# EAGLE design hacker-boards-refactor (EAGLE 7.3.0)
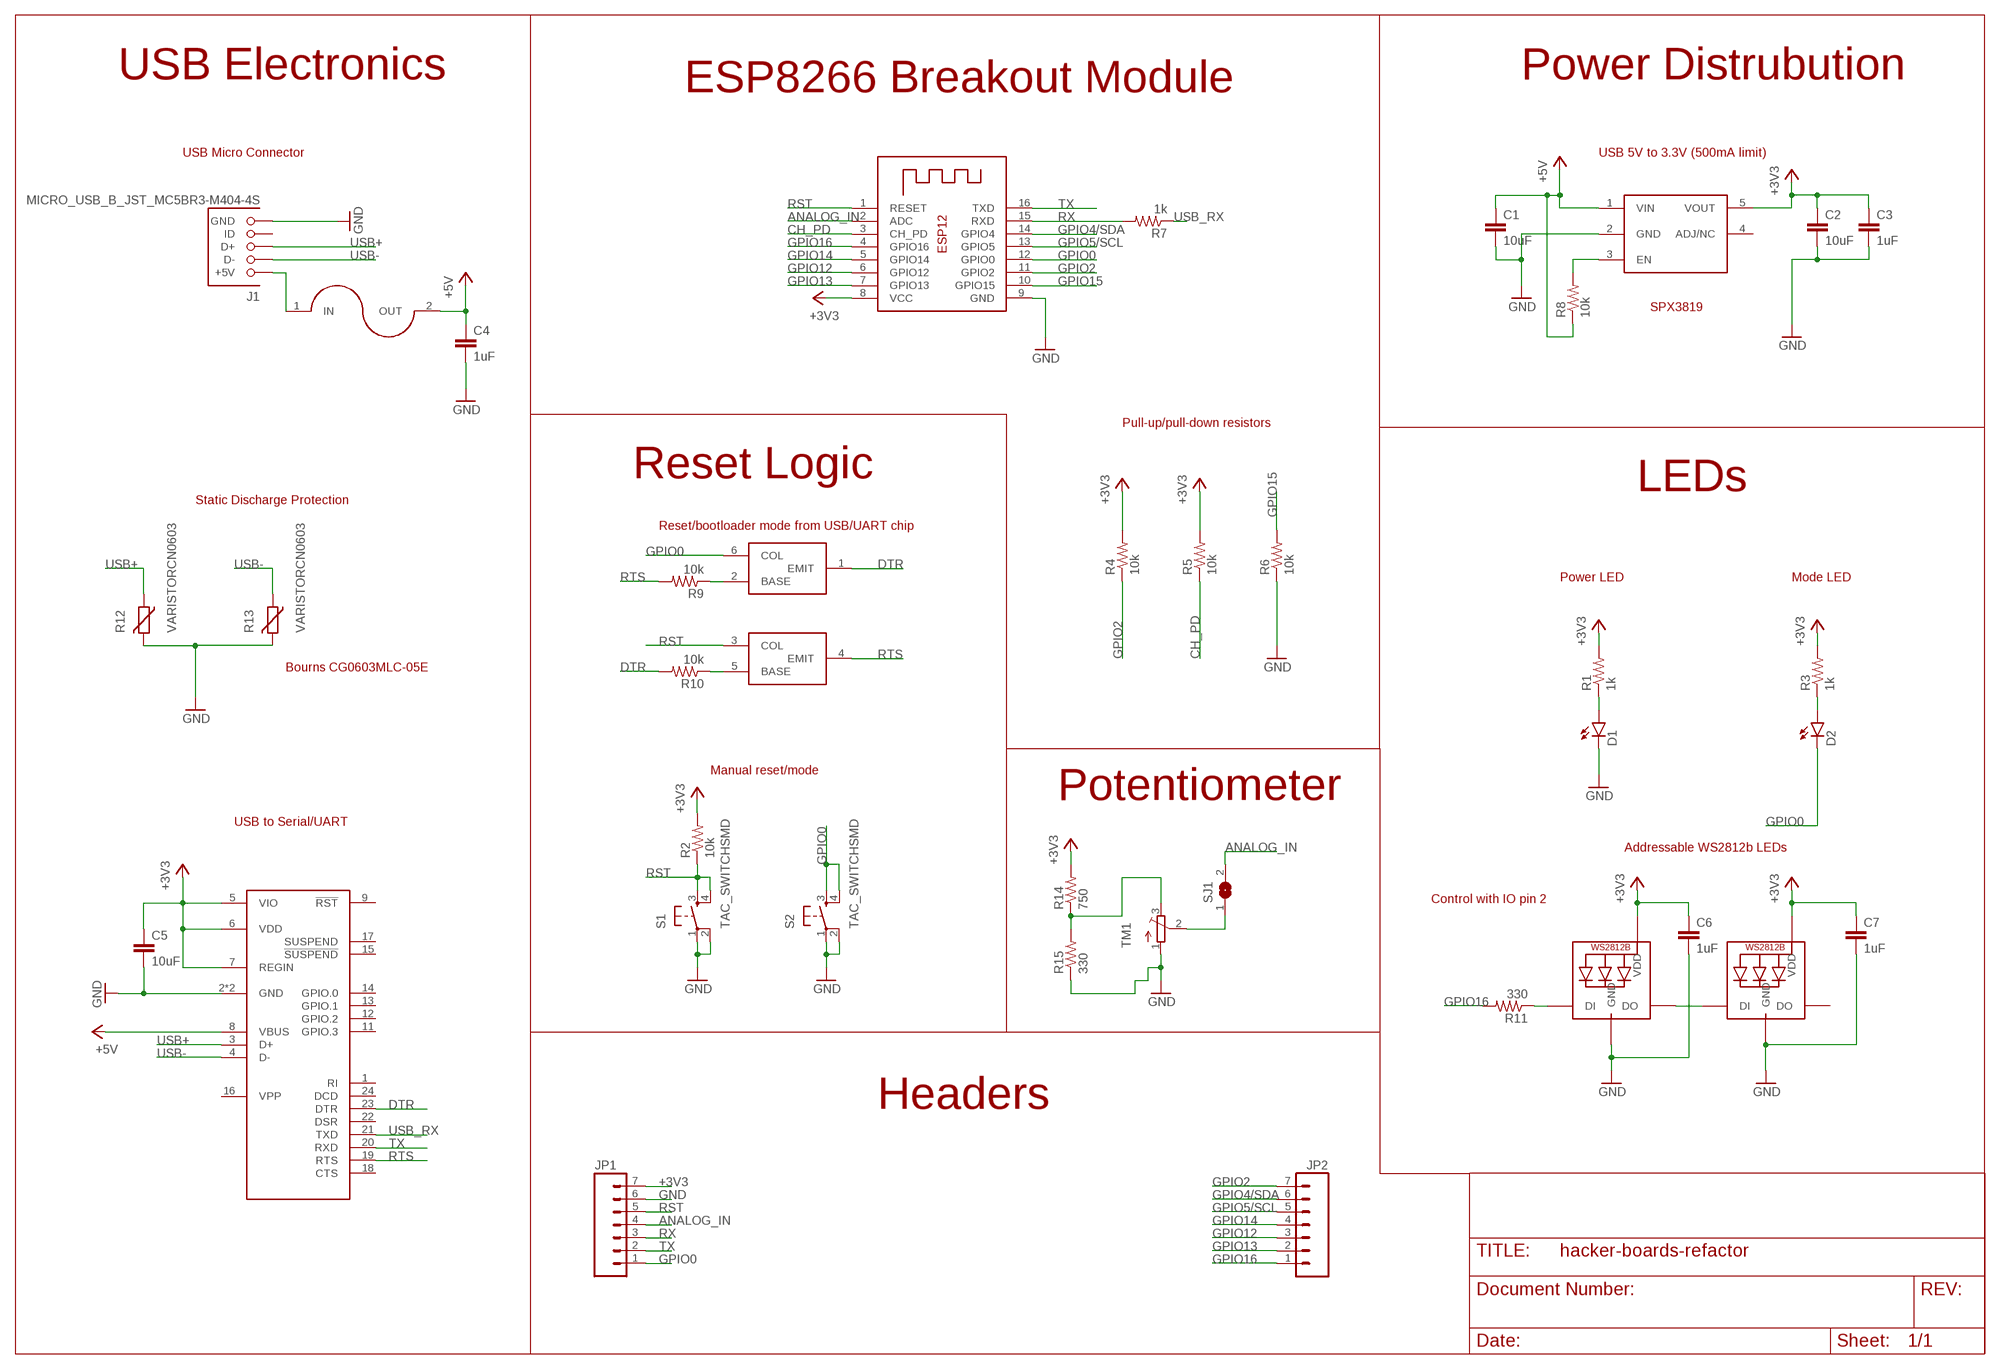
[diagram p0: schematic, sheet 1]

## Parts
C1  10uF  C0805  [C0805]
C2  10uF  C0805  [C0805]
C3  1uF  C0805  [C0805]
C4  1uF  C0805  [C0805]
C5  10uF  C0805  [C0805]
C6  1uF  C0805  [C0805]
C7  1uF  C0805  [C0805]
D1  LED0603  [LED-0603]
D2  LED0603  [LED-0603]
J1  MICRO_USB_B_JST_MC5BR3-M404-4S  [USB_MICRO_B-JST-MC5BR3-M404-4S-TB]
JP1  M07LONGPADS  [1X07_LONGPADS]
JP2  M07LONGPADS  [1X07_LONGPADS]
LED1  WS2812B5050  [WS2812B]
LED2  WS2812B5050  [WS2812B]
R1  1k  R-US_R0805  [R0805]
R2  10k  R-US_R0805  [R0805]
R3  1k  R-US_R0805  [R0805]
R4  10k  R-US_R0805  [R0805]
R5  10k  R-US_R0805  [R0805]
R6  10k  R-US_R0805  [R0805]
R7  1k  R-US_R0805  [R0805]
R8  10k  R-US_R0805  [R0805]
R9  10k  R-US_R0805  [R0805]
R10  10k  R-US_R0805  [R0805]
R11  330  R-US_R0805  [R0805]
R12  VARISTORCN0603  [CT/CN0603]
R13  VARISTORCN0603  [CT/CN0603]
R14  750  R-US_R0805  [R0805]
R15  330  R-US_R0805  [R0805]
S1  TAC_SWITCHSMD  [TACTILE-SWITCH-SMD]
S2  TAC_SWITCHSMD  [TACTILE-SWITCH-SMD]
SJ1  SJ  [SJ]
TM1  TRIMPOTTC33X  [TC33X]
U$1  USB-FUSE  [L1812]
U$2  AP2112  [SOT23-5L]
U$3  CP2104  [QFN24_4X4]
U$4  MBT3904DW1T1G  [SOT363]
X1  ESP-12  [ESP-12]

## Nets
+3V3: C2.1 C3.1 C5.1 C6.1 C7.1 JP1.7 LED1.1-VDD(VDD) LED2.1-VDD(VDD) R1.2 R2.2 R3.2 R4.2 R5.2 R14.2 U$2.5(VOUT) U$3.5(VIO) U$3.6(VDD) U$3.7(REGIN) X1.8(VCC)
+5V: C1.1 C4.1 R8.1 U$1.2(OUT) U$2.1(VIN) U$3.8(VBUS)
ANALOG_IN: JP1.4 SJ1.2 X1.2(ADC)
CH_PD: R5.1 X1.3(CH_PD)
DTR: R10.2 U$3.23(DTR) U$4.1(EMIT)
GND: C1.2 C2.2 C3.2 C4.2 C5.2 C6.2 C7.2 D1.C J1.5(GND) JP1.6 LED1.3-GND(GND) LED2.3-GND(GND) R6.1 R12.2 R13.2 R15.1 S1.1 S1.2 S2.1 S2.2 TM1.1(A) U$2.2(GND) U$3.2(GND) U$3.25(GND) X1.9(GND)
GPIO0: D2.C JP1.1 S2.3 S2.4 U$4.6(COL) X1.12(GPIO0)
GPIO2: JP2.7 R4.1 X1.11(GPIO2)
GPIO4/SDA: JP2.6 X1.14(GPIO4)
GPIO5/SCL: JP2.5 X1.13(GPIO5)
GPIO12: JP2.3 X1.6(GPIO12)
GPIO13: JP2.2 X1.7(GPIO13)
GPIO14: JP2.4 X1.5(GPIO14)
GPIO15: R6.2 X1.10(GPIO15)
GPIO16: JP2.1 R11.2 X1.4(GPIO16)
N$1: D1.A R1.1
N$2: J1.1(+5V) U$1.1(IN)
N$3: D2.A R3.1
N$4: R14.1 R15.2 TM1.3(E)
N$5: LED1.2-DOUT(DO) LED2.4-DIN(DI)
N$6: LED1.4-DIN(DI) R11.1
N$7: R8.2 U$2.3(EN)
N$8: R9.1 U$4.2(BASE)
N$11: R10.1 U$4.5(BASE)
N$12: SJ1.1 TM1.2(S)
RST: JP1.5 R2.1 S1.3 S1.4 U$4.3(COL) X1.1(RESET)
RTS: R9.2 U$3.19(RTS) U$4.4(EMIT)
RX: JP1.3 R7.2 X1.15(RXD)
TX: JP1.2 U$3.20(RXD) X1.16(TXD)
USB+: J1.3(D+) R12.1 U$3.3(D+)
USB-: J1.2(D-) R13.1 U$3.4(D-)
USB_RX: R7.1 U$3.21(TXD)
Unconnected: J1.4(ID) LED2.2-DOUT(DO) U$2.4(ADJ/NC) U$3.1(RI) U$3.9(!RST) U$3.11(GPIO.3) U$3.12(GPIO.2) U$3.13(GPIO.1) U$3.14(GPIO.0) U$3.15(!SUSPEND) U$3.16(VPP) U$3.17(SUSPEND) U$3.18(CTS) U$3.22(DSR) U$3.24(DCD)

## Notes on the sheet
- USB Electronics | Power Distrubution
- ESP8266 Breakout Module
- USB Micro Connector | USB 5V to 3.3V (500mA limit)
- SPX3819
- Pull-up/pull-down resistors
- Reset Logic
- LEDs
- Static Discharge Protection
- Reset/bootloader mode from USB/UART chip
- Power LED | Mode LED
- Bourns CG0603MLC-05E
- Manual reset/mode
- Potentiometer
- USB to Serial/UART
- Addressable WS2812b LEDs
- Control with IO pin 2
- Headers

## Library data of the parts
C1-C7 = hacker-board:C
D1 D2 = hacker-board:LED: LEDs Standard schematic elements and footprints for 5mm, 3mm, 1206, and 0603 sized LEDs. 5mm - Spark Fun Electronics SKU : COM-00529 (and others)
J1 = hacker-board:MICRO_USB_B_JST_MC5BR3-M404-4S: Micro USB B mid mount; DIGIKEY: 455-2567-2-ND; MOUSER: 53X3655
JP1 JP2 = hacker-board:M07: Header 7 Standard 7-pin 0.1" header. Use with straight break away headers (SKU : PRT-00116), right angle break away headers (PRT-00553), swiss pins (PRT-00743), machine pins (PRT-00117), and female headers (PRT-00115). NOTES ON THE VARIANTS LOCK and LOCK_LONGPADS... This footprint was designed to help hold the alignment of a through-hole component (i.e. 7-pin header) while soldering it into place. You may notice that each hole has been shifted either up or down by 0.005 of an inch from it's more standard position (which is usually a perfectly straight line). This slight alteration caused the pins (the squares in the middle) to touch the edges of the holes. Because they are alternating, it causes a "brace" to hold the header in place. 0.005 has proven to be the perfect amount of "off-center" position when using our standard breakaway headers. Although looks a little odd when you look at the bare footprint, once you have a header in there, the alteration is very hard to notice. Also, if you push a header all the way into place, it is covered up entirely on the bottom side. This idea of altering the position of holes to aid alignment will be further integrated into the Sparkfun Library for other footprints. It can help hold any component with 3 or more connection pins.
LED1 LED2 = hacker-board:WS2812B
R1-R11 R14 R15 = resistor:R-US_: RESISTOR, American symbol
R12 R13 = varistor:VARISTOR: VARISTOR
S1 S2 = hacker-board:TAC_SWITCH: Momentary Switch Button commonly used for reset or general input. Spark Fun Electronics SKU : COM-00097 SMT- SWCH-08247; PROD_ID: SWCH-08247
SJ1 = jumper:SJ: SMD solder JUMPER
TM1 = adafruit:TRIMPOT: SMT trimmer potentiometer part number TC33X http://www.ladyada.net/library/eagle
U$1 = hacker-board:USB-FUSE: MF-MSMF075-2
U$2 = hacker-board:AP2112
U$3 = hacker-board:CP2104
U$4 = hacker-board:MBT3904DW1T1G
X1 = hacker-board:ESP-12

## Board
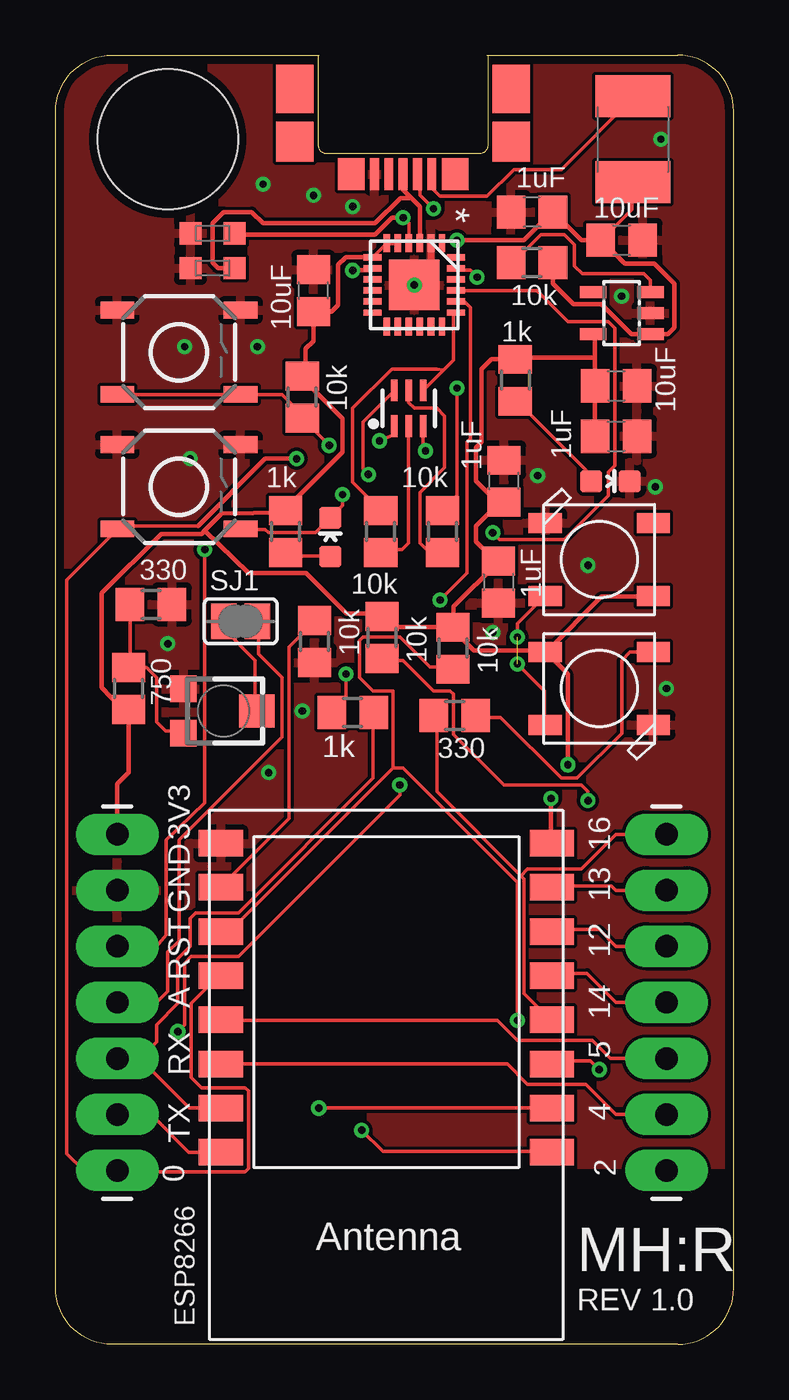
[diagram p1: board, top side]
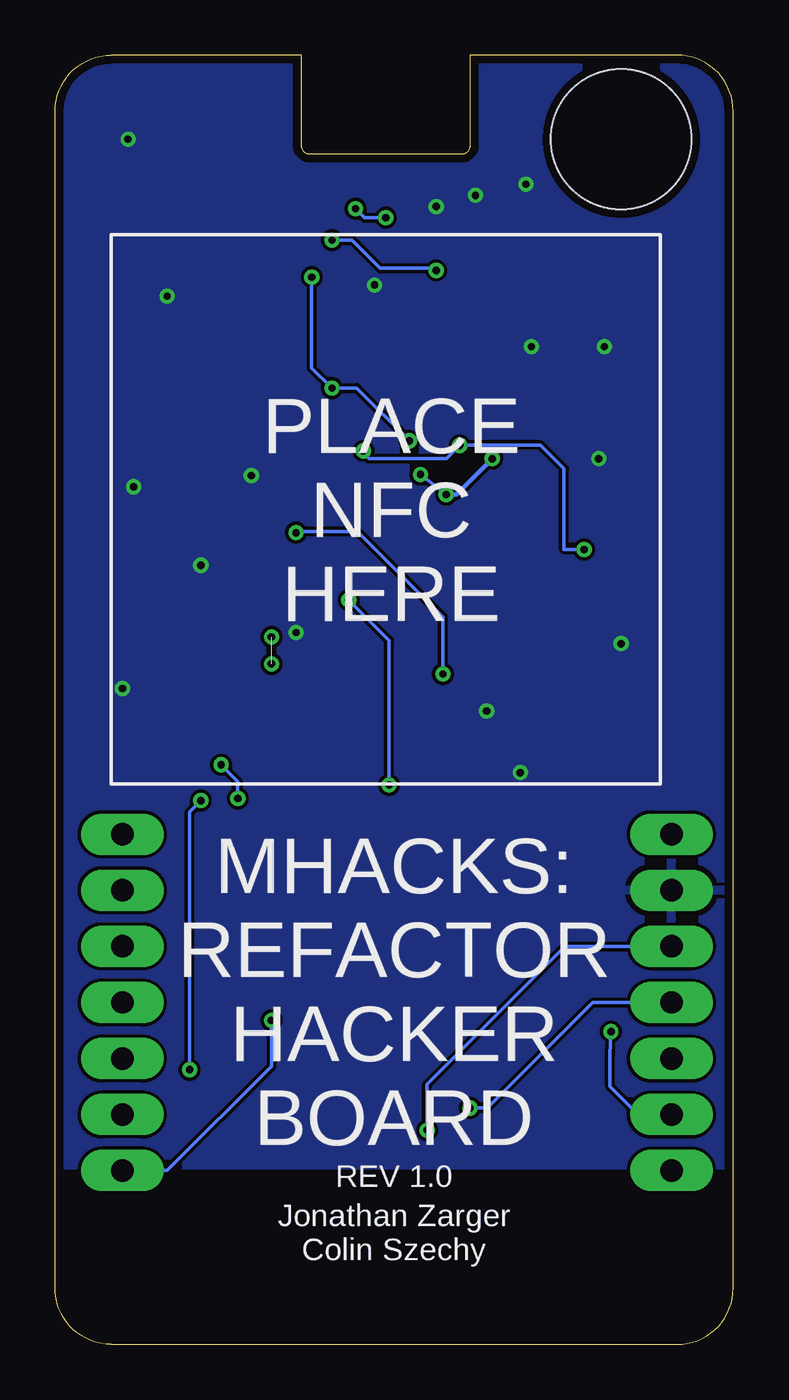
[diagram p2: board, bottom side, seen from below]

Size 30.73 x 58.42 mm. Coordinates in mm from the lower left corner, seen from the top.
Outline: 11.94,58.42 2.54,58.42 arc90 0,55.88 0,2.54 arc90 2.54,0 28.19,0 arc90 30.73,2.54 30.73,55.88 arc90 28.19,58.42 19.56,58.42
Copper layers (1*16): Top 0.0356mm / dielectric 1.5011mm / Bottom 0.0356mm
Design rules "LaenPCBOrder": minimum track width 6mil, minimum drill 13mil, track to track 6mil, track to pad 6mil, pad to pad 6mil, via to via 6mil, smd to smd 6mil, copper to edge 15mil, drill to drill 6mil, minimum pad ring 7mil, minimum via ring 7mil, stop-mask expansion 3mil, vias tented up to drill 0mil, thermal gap 10mil
Holes 6.35 mm at 5.08,54.61

### Footprints (pad centres in the part's own frame; a part is rotated, then mirrored left to right if it is on the bottom)
C0805 = smd 1.3 x 1.5: 1 -0.95,0; 2 0.95,0
LED-0603 = smd 1 x 1: A 0,-0.877; C 0,0.877
USB_MICRO_B-JST-MC5BR3-M404-4S-TB = smd 0.4 x 1.45: 1 -1.3,3.875; 2 -0.65,3.875; 3 0,3.875; 4 0.65,3.875; 5 1.3,3.875 | smd 1.7 x 2.2: P$1 -4.9,0; P$2 4.9,0 | smd 1.7 x 1.8: P$3 -4.9,2.4; P$4 4.9,2.4 | smd 1.2 x 1.45: P$5 -2.35,3.875; P$6 2.35,3.875
1X07_LONGPADS = drill 1.016 pad 1.88 long: 1 0,0; 2 2.54,0; 3 5.08,0; 4 7.62,0; 5 10.16,0; 6 12.7,0; 7 15.24,0
WS2812B = smd 1.5 x 0.9: 1-VDD 2.45,-1.65; 2-DOUT 2.45,1.65; 3-GND -2.45,1.65; 4-DIN -2.45,-1.65
R0805 = smd 1.3 x 1.5: 1 -0.95,0; 2 0.95,0
CT/CN0603 = smd 1 x 1: 1 -1,0; 2 1,0
TACTILE-SWITCH-SMD = smd 1.524 x 0.762: 1 -2.794,1.905; 2 2.794,1.905; 3 -2.794,-1.905; 4 2.794,-1.905
SJ = smd 1.168 x 1.6: 1 -0.762,0; 2 0.762,0
TC33X = smd 1.2 x 1.2: 1 -1,-1.825; 3 1,-1.825 | smd 1.5 x 1.6: 2 0,1.5
L1812 = smd 1.9 x 3.4: 1 -1.95,0; 2 1.95,0
SOT23-5L = smd 0.55 x 1.2: 1 -0.95,-1.3; 2 0,-1.3; 3 0.95,-1.3; 4 0.95,1.3; 5 -0.95,1.3
QFN24_4X4 = smd 0.813 x 0.279: 1 -1.892,1.25; 6 -1.892,-1.25; 13 1.892,-1.25; 18 1.892,1.25 | smd 0.813 x 0.305: 2 -1.892,0.75; 3 -1.892,0.25; 4 -1.892,-0.25; 5 -1.892,-0.75; 14 1.892,-0.75; 15 1.892,-0.25; 16 1.892,0.25; 17 1.892,0.75 | smd 0.279 x 0.813: 7 -1.25,-1.892; 12 1.25,-1.892; 19 1.25,1.892; 24 -1.25,1.892 | smd 0.305 x 0.813: 8 -0.75,-1.892; 9 -0.25,-1.892; 10 0.25,-1.892; 11 0.75,-1.892; 20 0.75,1.892; 21 0.25,1.892; 22 -0.25,1.892; 23 -0.75,1.892 | smd 2.286 x 2.286: 25 0,0
SOT363 = smd 0.3 x 0.99: 1 -0.65,-0.8; 2 0,-0.8; 3 0.65,-0.8; 4 0.65,0.81; 5 0,0.81; 6 -0.65,0.81
ESP-12 = smd 2 x 1.2: 1 -7.5,4.5; 2 -7.5,2.5; 3 -7.5,0.5; 4 -7.5,-1.5; 5 -7.5,-3.5; 6 -7.5,-5.5; 7 -7.5,-7.5; 8 -7.5,-9.5; 9 7.5,-9.5; 10 7.5,-7.5; 11 7.5,-5.5; 12 7.5,-3.5; 13 7.5,-1.5; 14 7.5,0.5; 15 7.5,2.5; 16 7.5,4.5

### Placement (x,y rotation side)
C1  25.65,50.04 0 top
C2  25.4,43.43 0 top
C3  25.4,41.15 0 top
C4  21.59,51.31 180 top
C5  11.68,47.75 90 top
C6  20.07,34.54 270 top
C7  20.32,39.12 90 top
D1  25.15,39.12 270 top
D2  12.45,36.58 0 top
J1  15.75,56.9 180 top
JP1  2.79,7.87 90 top
JP2  27.69,23.11 270 top
LED1  24.64,29.72 180 top
LED2  24.64,35.56 0 top
R1  20.83,43.69 90 top
R2  11.18,42.93 90 top
R3  10.41,36.83 90 top
R4  18.01,31.55 90 top
R5  14.78,32.03 90 top
R6  11.73,31.85 90 top
R7  13.46,28.63 0 top
R8  21.59,49.02 180 top
R9  14.73,36.83 90 top
R10  17.53,36.83 90 top
R11  18.08,28.5 180 top
R12  7.11,48.77 180 top
R13  7.11,50.34 180 top
R14  3.3,29.72 270 top
R15  4.32,33.53 180 top
S1  5.59,44.96 0 top
S2  5.59,38.86 0 top
SJ1  8.38,32.77 0 top
TM1  7.62,28.7 270 top
U$1  26.16,54.61 270 top
U$2  25.65,46.74 90 top
U$3  16.26,48.01 270 top
U$4  16,42.42 0 top
X1  14.99,13.21 180 top

### Tracks (layer width: path | path; a pad name or v marks a point on that pad's centre or on a via)
+3V3  (via drill 0.33)
  Top 0.152: 24.43,45.77 U$2.5 | 24.43,43.48 C2.1 24.43,43.33 | 20.93,44.7 R1.2 20.78,44.55 | 24.43,41.2 C3.1 | 17.88,32.51 R4.2 | 14.83,32.97 R5.2 14.68,33.12 | 22.15,31.45 LED1.1-VDD | 18.03,32.36 R4.2 | 27.03,33.88 LED2.1-VDD | 22.3,31.45 LED1.1-VDD | 18.03,32.51 R4.2 | 20.02,35.41 C6.1 | 22.45,22.76 X1.8 | 22.3,31.29 LED1.1-VDD | 20.02,38.3 C7.1 | U$3.5 15.44,49.89 15.14,49.89 U$3.6 14.99,49.89 14.38,49.28 U$3.7 14.22,49.28 | 10.41,37.85 R3.2 10.41,37.69 | 11.18,43.79 R2.2 11.18,43.94 11.33,44.09 | 2.95,28.85 R14.2
  Top 0.203: 24.43,43.48 24.43,44.7 | 24.43,44.7 24.43,45.77 | 24.43,44.7 20.93,44.7 | 24.43,43.33 24.43,41.2 | 17.88,32.51 15.29,32.51 14.83,32.97 | 22.15,31.45 18.95,31.45 18.03,32.36 | 27.03,33.88 24.74,33.88 22.3,31.45 | 18.03,32.51 18.03,33.43 20.02,35.41 19.05,36.37 19.05,37.08 20.13,38.17 C7.1 20,38.17 19.05,39.12 19.05,40.64 19.3,40.89 19.3,44.2 19.75,44.64 R1.2 | v22.45,24.74 22.45,22.76 | v23.22,26.26 23.22,30.38 22.3,31.29 | 14.22,49.28 13.16,49.28 12.8,48.92 12.8,47.09 12.51,46.8 C5.1 11.68,45.47 11.33,45.11 11.33,44.09 | 10.41,37.85 13.01,40.44 13.01,41.96 11.18,43.79 | 6.76,36.88 7.52,37.64 10.41,37.69 | 6.76,36.88 6.6,36.73 4.78,36.73 2.08,34.04 2.08,29.77 2.95,28.85 | 14.68,33.12 13.18,33.12 11.35,34.95 8.74,34.95 6.76,36.88 | R14.2 3.3,25.91 2.79,25.4 JP1.7
  Bottom 0.152: v22.45,24.74 22.45,25.5 v23.22,26.26
+5V  (via drill 0.33)
  Top 0.152: 22.61,48.97 R8.1 | 22.45,51.26 C4.1 22.61,51.26 | U$1.2 26.11,52.63 26.11,51.41 24.74,50.04 C1.1
  Top 0.203: v13.46,48.67 14.22,48.67 U$3.8 | v18.19,50.04 21.23,50.04 22.45,51.26 | C1.1 23.82,50.04 22.61,51.26 | 24.74,50.04 25.81,48.97 27.13,48.97 28.04,48.06 28.04,46.08 27.75,45.79 U$2.1 26.1,45.79 24.74,47.14 23.47,47.14 22.54,48.07 R8.1
  Bottom 0.152: v18.19,50.04 17.27,50.04 16,48.77 13.56,48.77 v13.46,48.67
ANALOG_IN  (via drill 0.33)
  Top 0.152: SJ1.2 9.2,32.66 9.2,31.29 10.26,30.23 10.26,27.53 5.59,22.86 5.59,18.29 5.08,17.78 5.08,16 4.57,15.49 JP1.4 | 22.45,10.72 X1.2 v11.93,10.71
  Bottom 0.152: v11.93,10.71 11.14,10.71 6.35,15.49 JP1.4
CH_PD  (via drill 0.33)
  Top 0.152: R5.1 14.83,30.99 15.75,30.99 17.12,29.62 17.88,29.62 18.03,29.46 18.03,27.64 20.32,25.35 23.82,25.35 24.13,25.04 v24.13,24.64 | X1.3 22.61,12.85 24.23,12.85 v24.64,12.45
  Bottom 0.152: v24.64,12.45 24.64,24.13 v24.13,24.64
DTR  (via drill 0.33)
  Top 0.152: v19.1,48.36 18.8,48.67 18.19,48.67 U$3.23 | v18.19,43.33 18.19,38.46 17.58,37.85 R10.2 | v14.68,40.95 15.29,41.2 U$4.1
  Bottom 0.152: v19.1,48.36 19.1,44.25 v18.19,43.33 17.07,43.33 v14.68,40.95
GND  (via drill 0.33)
  Top 0.152: 16.97,48.67 16.36,48.06 U$3.25 | 16.97,49.89 U$3.2 | 20.62,51.26 C4.2
  Top 0.305: 16.97,48.67 17.01,48.7 U$3.2
  other vias: 9.4,52.58 11.68,52.07 13.46,51.56 5.84,45.21 9.14,45.21 6.1,40.13 5.08,31.75 11.18,28.7 27.18,38.86 21.84,39.37 24.13,35.31 19.81,32.26 25.65,47.5 9.65,25.91 16.26,48.01 27.69,29.72 27.43,54.61
  pour Top: 0,58.42 30.73,58.42 30.73,8.13 0,8.13
  pour Bottom: 0,58.42 30.73,58.42 30.73,8.13 0,8.13
GPIO0  (via drill 0.33)
  Top 0.152: 7.37,16.66 X1.12 7.41,16.71 6.15,15.44 6.15,12.09 6.6,11.63 8.59,11.63 8.74,11.48 8.74,7.98 8.59,7.82 2.85,7.82 JP1.1 1.27,7.87 0.51,8.64 0.51,34.65 2.79,36.93 S2.3 2.79,37.08 6.45,37.08 | v13.01,38.51 13.01,38 12.55,37.54 D2.C 12.39,37.39 11.79,36.78 9.65,36.78 9.5,36.93 8.43,36.93 S2.4 | v14.17,39.42 13.92,39.67 13.92,41.8 U$4.6
  Top 0.203: 6.45,37.08 9.5,40.13 v10.92,40.13
  Bottom 0.152: v13.01,38.51 v14.17,39.42
  Bottom 0.203: v10.92,40.13 12.55,38.51 v13.01,38.51
GPIO2  (via drill 0.33)
  Top 0.152: 15.29,26.11 15.29,29.62 14.38,29.62 13.77,30.23 13.77,31.9 13.92,32.05 15.6,32.05 16.97,30.68 17.88,30.68 R4.1 | 15.29,26.11 7.98,18.8 7.52,18.8 X1.11 | v20.93,14.68 20.93,20.93 15.75,26.11 15.29,26.11
  Bottom 0.152: v20.93,14.68 20.93,12.6 25.65,7.87 JP2.7
GPIO4/SDA
  Top 0.152: X1.14 7.52,12.7 20.47,12.7 21.39,11.79 24.03,11.79 25.4,10.41 JP2.6
GPIO5/SCL
  Top 0.152: X1.13 7.52,14.68 20.02,14.68 20.93,13.77 24.33,13.77 25.15,12.95 JP2.5
GPIO12
  Top 0.152: X1.6 22.61,18.8 24.64,18.8 25.4,18.03 JP2.3
GPIO13
  Top 0.152: X1.7 22.61,20.78 25.2,20.78 25.4,20.57 JP2.2
GPIO14
  Top 0.152: X1.5 22.61,16.82 24.08,16.82 25.4,15.49 JP2.4
GPIO15
  Top 0.152: R6.2 11.63,32.66 10.57,31.6 10.57,23.82 7.52,20.78 X1.10
GPIO16
  Top 0.152: 21.08,21.23 21.23,21.08 21.23,15.9 22.45,14.68 X1.4 | 21.08,21.23 17.27,25.04 17.27,28.4 R11.2 | 21.08,21.23 21.39,21.54 23.82,21.54 25.4,23.11 JP2.1
N$1
  Top 0.152: D1.A 24.13,39.22 24.13,39.52 20.93,42.72 R1.1
N$2
  Top 0.152: J1.1 17.12,52.93 17.12,52.32 17.42,52.02 19.56,52.02 20.78,53.24 22.91,53.24 26.11,56.44 U$1.1
N$3
  Top 0.152: D2.A 12.39,35.71 10.57,35.71 10.41,35.87 R3.1
N$4
  Top 0.152: TM1.3 5.69,27.79 4.98,27.79 4.57,28.19 4.57,30.23 4.13,30.67 R14.1 | 3.1,30.53 R14.1 | R14.1 3.1,30.68 3.37,30.95 R15.2
N$5  (via drill 0.33)  (1 unrouted)
  Top 0.152: v20.93,30.84 22.15,29.62 22.15,28.09 LED1.2-DOUT | v20.93,32.05 20.93,32.66 22.15,33.88 LED2.4-DIN
N$6
  Top 0.152: R11.1 19.1,28.4 20.17,28.4 22.91,25.65 23.62,25.65 25.65,27.69 25.65,30.99 26.03,31.37 LED1.4-DIN 27.03,31.29
N$7
  Top 0.152: 26.87,47.75 U$2.3 26.95,48.23 26.67,48.51 23.88,48.51 23.52,48.87 23.52,49.84 23.06,50.29 22,50.29 20.78,49.07 R8.2
N$8
  Top 0.152: R9.1 14.83,36.02 15.7,36.02 16,36.32 U$4.2
N$11
  Top 0.152: R10.1 17.42,36.02 16.82,36.02 16.51,36.32 16.51,38.61 17.63,39.73 17.63,42.06 17.27,42.42 16.26,42.42 16,42.67 U$4.5
N$12
  Top 0.152: TM1.2 9.04,28.7 9.04,30.99 7.67,32.36 7.67,32.66 SJ1.1
RST  (via drill 0.33)
  Top 0.152: S1.3 2.79,43.03 8.28,43.03 S1.4 8.43,43.03 10.26,43.03 11.18,42.11 R2.1 11.18,41.96 v12.39,40.74 | v13.87,9.7 14.83,8.74 22.45,8.74 X1.1 | v6.76,36.02 6.76,24.54 5,22.86 5,18.54 4.57,18.03 JP1.5 | U$4.3 16.65,40.6 v16.76,40.49
  Bottom 0.152: v16.76,40.49 16.66,40.39 16.66,40.28 16.51,40.13 13.01,40.13 v12.39,40.74 8.74,40.74 7.67,39.67 7.67,36.02 v6.76,36.02 | v13.87,9.7 13.87,11.79 7.62,18.03 JP1.5
RTS
  Top 0.152: 17.58,44.15 16.66,43.23 U$4.4 | 17.58,44.15 18.03,44.6 18.03,46.69 U$3.19 | R9.2 14.68,37.85 13.46,39.06 13.46,42.42 15.24,44.2 17.27,44.2 17.58,44.15
RX
  Top 0.152: R7.2 14.38,28.55 14.38,25.65 8.28,19.56 6.35,19.56 6.1,19.3 6.1,18.03 5.54,17.48 5.54,15.44 4.57,14.48 4.57,13.72 3.81,12.95 | 7.06,10.72 7.37,10.72 X1.15 6.06,10.71 3.81,12.95 | JP1.3 3.81,12.95
TX  (via drill 0.33)
  Top 0.152: v17.42,33.73 18.64,34.95 18.64,40.89 18.8,41.05 18.8,46.99 18.53,47.26 U$3.20 | v15.6,25.35 15.6,24.89 8.28,17.58 6.15,17.58 5.84,17.27 5.84,14.48 v5.54,14.17 | X1.16 6.02,8.71 4.32,10.41 JP1.2
  Bottom 0.152: JP1.2 4.32,10.41 5.59,11.68 5.59,13.11 v5.54,14.17 | v15.6,25.35 15.6,31.9 v17.42,33.73
USB+
  Top 0.152: 16.51,50.04 U$3.3 | 15.75,52.93 J1.3
  Top 0.203: 16.51,50.04 16.51,51.56 16.13,51.94 | 16.13,51.94 15.75,52.32 J1.3 | R12.1 7.37,48.77 7.11,49.02 7.11,50.8 7.62,51.31 8.89,51.31 9.4,50.8 14.48,50.8 15.62,51.94 16.13,51.94
USB-  (via drill 0.33)
  Top 0.152: v17.12,51.46 16.51,52.07 16.51,52.93 J1.2 | v15.75,51.05 16.01,50.8 U$3.4
  Top 0.203: v15.75,51.05 15.24,51.05 14.48,50.29 8.16,50.29 R13.1
  Bottom 0.152: v17.12,51.46 16.71,51.05 v15.75,51.05
USB_RX  (via drill 0.33)
  Top 0.152: v19.81,36.78 20.12,36.47 23.06,36.47 25.04,38.46 25.04,39.52 25.35,39.83 25.35,46.05 25.04,46.35 23.22,46.35 21.82,47.75 18.19,47.75 U$3.21 | v13.16,30.38 13.16,29.31 12.55,28.7 R7.1
  Bottom 0.152: v13.16,30.38 13.16,32.97 17.02,36.83 19.76,36.83 v19.81,36.78

### Text on the board
tNames: 3V3 | 16 | GND | 13 | 12 | RST | A | 14 | 5 | RX | 4 | TX | 2 | 0 | ESP8266 | MH:R | REV 1.0
bNames: PLACE / NFC / HERE | MHACKS: / REFACTOR / HACKER / BOARD | REV 1.0 | Jonathan Zarger / Colin Szechy